# Altium schematic sheet RFID_GATEWAY.SchDoc
size A
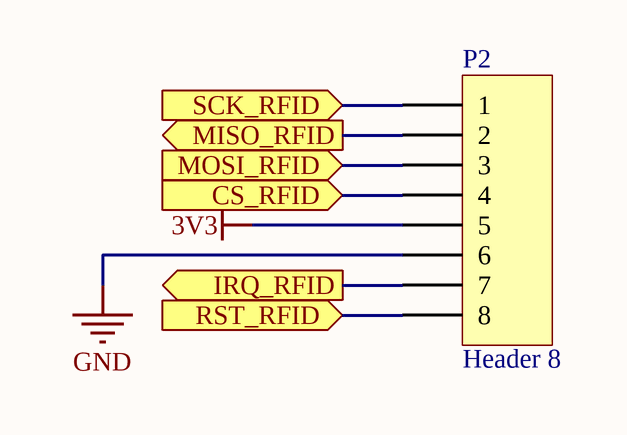
[diagram p0: RFID_GATEWAY.SchDoc]

## Parts
P2  Header 8  [Header 8]

## Ports
CS_RFID (in), IRQ_RFID (out), MISO_RFID (out), MOSI_RFID (in), RST_RFID (in), SCK_RFID (in)

## Nets
3V3: P2.5
GND: P2.6
CS_RFID: P2.4 ; port CS_RFID
IRQ_RFID: P2.7 ; port IRQ_RFID
MISO_RFID: P2.2 ; port MISO_RFID
MOSI_RFID: P2.3 ; port MOSI_RFID
RST_RFID: P2.8 ; port RST_RFID
SCK_RFID: P2.1 ; port SCK_RFID

## Library data of the parts
P2 = Header 8: Header, 8-Pin; LatestRevisionDate: 17-Jul-2002; LatestRevisionNote: Re-released for DXP Platform.; Publisher: Altium Limited